# EAGLE schematic DingDingMusicCircuitBoard 1.0 (EAGLE 7.3.0)

## Sheet 1 of 4
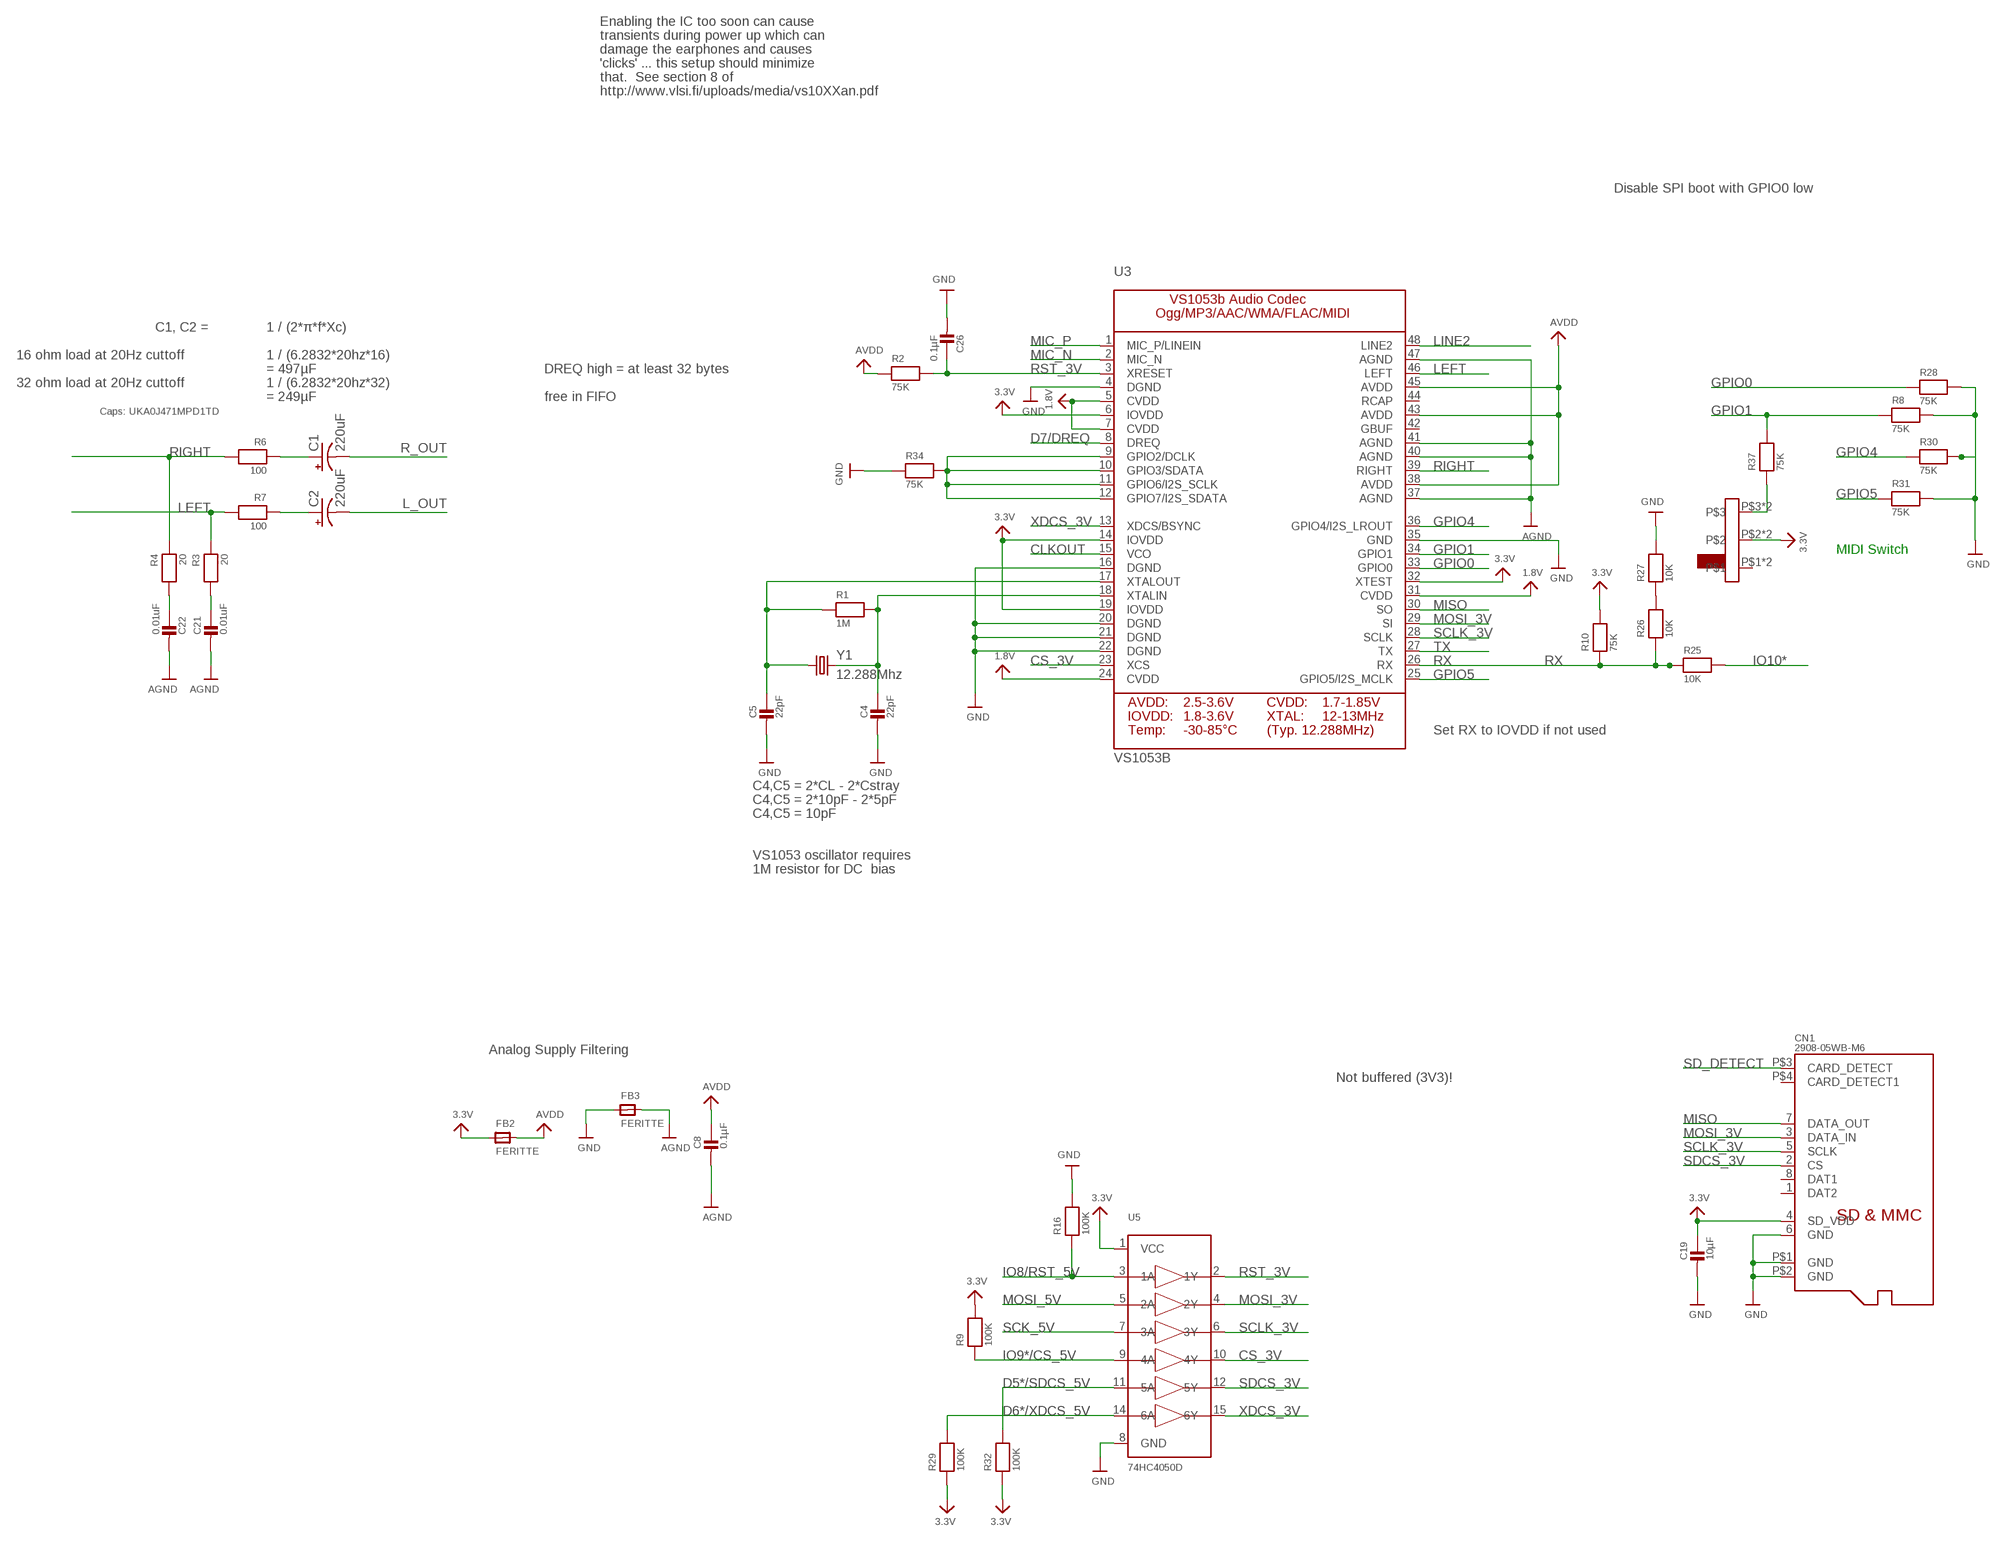
[diagram p0: schematic, sheet 1]

### Parts
C1  220uF  CPOL-USD  [PANASONIC_D]
C2  220uF  CPOL-USD  [PANASONIC_D]
C4  22pF  CAP_CERAMIC_0603MP  [_0603MP]
C5  22pF  CAP_CERAMIC_0603MP  [_0603MP]
C8  0.1µF  CAP_CERAMIC_0603MP  [_0603MP]
C19  10µF  CAP_CERAMIC_0603MP  [_0603MP]
C21  0.01uF  CAP_CERAMIC_0603MP  [_0603MP]
C22  0.01uF  CAP_CERAMIC_0603MP  [_0603MP]
C26  0.1µF  CAP_CERAMIC_0603MP  [_0603MP]
CN1  2908-05WB-M6  MICROSDMSDC-M61408  [MICROSD_MSDC-M61408]
FB2  FERITTE  FERRITE_0805MP  [_0805MP]
FB3  FERITTE  FERRITE_0805MP  [_0805MP]
R1  1M  RESISTOR_0603MP  [_0603MP]
R2  75K  RESISTOR_0603MP  [_0603MP]
R3  20  RESISTOR_0603MP  [_0603MP]
R4  20  RESISTOR_0603MP  [_0603MP]
R6  100  RESISTOR_0603MP  [_0603MP]
R7  100  RESISTOR_0603MP  [_0603MP]
R8  75K  RESISTOR_0603MP  [_0603MP]
R9  100K  RESISTOR_0603MP  [_0603MP]
R10  75K  RESISTOR_0603MP  [_0603MP]
R16  100K  RESISTOR_0603MP  [_0603MP]
R25  10K  RESISTOR_0603MP  [_0603MP]
R26  10K  RESISTOR_0603MP  [_0603MP]
R27  10K  RESISTOR_0603MP  [_0603MP]
R28  75K  RESISTOR_0603MP  [_0603MP]
R29  100K  RESISTOR_0603MP  [_0603MP]
R30  75K  RESISTOR_0603MP  [_0603MP]
R31  75K  RESISTOR_0603MP  [_0603MP]
R32  100K  RESISTOR_0603MP  [_0603MP]
R34  75K  RESISTOR_0603MP  [_0603MP]
R37  75K  RESISTOR_0603MP  [_0603MP]
U3  VS1053B  [LQFP48]
U5  74HC4050D  [SOIC16]
U$42  SWITCH_SK-02ACTS-2235S  [SWITCH_CTS-2235S]
Y1  12.288Mhz  CRYSTAL5X3  [CRYSTAL-SMD-5X3]

### Nets
1.8V: U3.5(CVDD) U3.7(CVDD) U3.24(CVDD) U3.31(CVDD) ; also sheet 3
3.3V: C19.1 CN1.4(SD_VDD) FB2.1 R9.2 R10.2 R29.1 R32.1 U3.6(IOVDD) U3.14(IOVDD) U3.19(IOVDD) U3.32(XTEST) U5.1(VCC) U$42.P$2 U$42.P$5 ; also sheet 2,3,4
AGND: C8.2 C21.2 C22.2 FB3.2 U3.37(AGND) U3.40(AGND) U3.41(AGND) U3.47(AGND) ; also sheet 4
AVDD: C8.1 FB2.2 R2.1 U3.38(AVDD) U3.43(AVDD) U3.45(AVDD)
CLKOUT: U3.15(VCO)
CS_3V: U3.23(XCS) U5.10(4Y)
D5*/SDCS_5V: R32.2 U5.11(5A) ; also sheet 3
D6*/XDCS_5V: R29.2 U5.14(6A) ; also sheet 3
D7/DREQ: U3.8(DREQ) ; also sheet 3
GND: C4.2 C5.2 C19.2 C26.2 CN1.6(GND) CN1.P$1(GND) CN1.P$2(GND) FB3.1 R8.2 R16.2 R27.2 R28.2 R30.2 R31.2 R34.1 U3.4(DGND) U3.16(DGND) U3.20(DGND) U3.21(DGND) U3.22(DGND) U3.35(GND) U5.8(GND) ; also sheet 2,3,4
GPIO0: R28.1 U3.33(GPIO0)
GPIO1: R8.1 R37.2 U3.34(GPIO1) ; also sheet 3
GPIO3: R34.2 U3.9(GPIO2/DCLK) U3.10(GPIO3/SDATA) U3.11(GPIO6/I2S_SCLK) U3.12(GPIO7/I2S_SDATA)
GPIO4: R30.1 U3.36(GPIO4/I2S_LROUT)
GPIO5: R31.1 U3.25(GPIO5/I2S_MCLK)
IO8/RST_5V: R16.1 U5.3(1A) ; also sheet 3
IO9*/CS_5V: R9.1 U5.9(4A) ; also sheet 3
IO10*: R25.2 ; also sheet 3
L_OUT: C2.- ; also sheet 4
LEFT: R3.1 R7.2 U3.46(LEFT)
LEFT_FILTERED: C2.+ R7.1
LINE2: U3.48(LINE2)
MIC_N: U3.2(MIC_N)
MIC_P: U3.1(MIC_P/LINEIN)
MISO: CN1.7(DATA_OUT) U3.30(SO) ; also sheet 3
MOSI_3V: CN1.3(DATA_IN) U3.29(SI) U5.4(2Y)
MOSI_5V: U5.5(2A) ; also sheet 3
N$1: C5.1 R1.1 U3.17(XTALOUT) Y1.1
N$2: C4.1 R1.2 U3.18(XTALIN) Y1.3
N$5: C21.1 R3.2
N$6: C22.1 R4.2
N$14: R37.1 U$42.P$3 U$42.P$6
N$28: R26.2 R27.1
R_OUT: C1.- ; also sheet 4
RIGHT: R4.1 R6.2 U3.39(RIGHT)
RIGHT_FILTERED: C1.+ R6.1
RST_3V: C26.1 R2.2 U3.3(XRESET) U5.2(1Y)
RX: R10.1 R25.1 R26.1 U3.26(RX)
SCK_5V: U5.7(3A) ; also sheet 3
SCLK_3V: CN1.5(SCLK) U3.28(SCLK) U5.6(3Y)
SD_DETECT: CN1.P$3(CARD_DETECT)
SDCS_3V: CN1.2(CS) U5.12(5Y)
TX: U3.27(TX)
XDCS_3V: U3.13(XDCS/BSYNC) U5.15(6Y)
Unconnected: CN1.1(DAT2) CN1.8(DAT1) CN1.P$4(CARD_DETECT1) U3.42(GBUF) U3.44(RCAP) U$42.P$1 U$42.P$4

### Notes on the sheet
- Enabling the IC too soon can cause
- transients during power up which can
- damage the earphones and causes
- 'clicks' ... this setup should minimize
- that.  See section 8 of
- http://www.vlsi.fi/uploads/media/vs10XXan.pdf
- Disable SPI boot with GPIO0 low
- C1, C2 = | 1 / (2*π*f*Xc)
- 16 ohm load at 20Hz cuttoff | 1 / (6.2832*20hz*16)
- = 497µF | DREQ high = at least 32 bytes
- 32 ohm load at 20Hz cuttoff | 1 / (6.2832*20hz*32)
- = 249µF | free in FIFO
- Caps: UKA0J471MPD1TD
- MIDI Switch
- Set RX to IOVDD if not used
- C4,C5 = 2*CL - 2*Cstray
- C4,C5 = 2*10pF - 2*5pF
- C4,C5 = 10pF
- VS1053 oscillator requires
- 1M resistor for DC  bias
- Analog Supply Filtering
- Not buffered (3V3)!

## Sheet 2 of 4
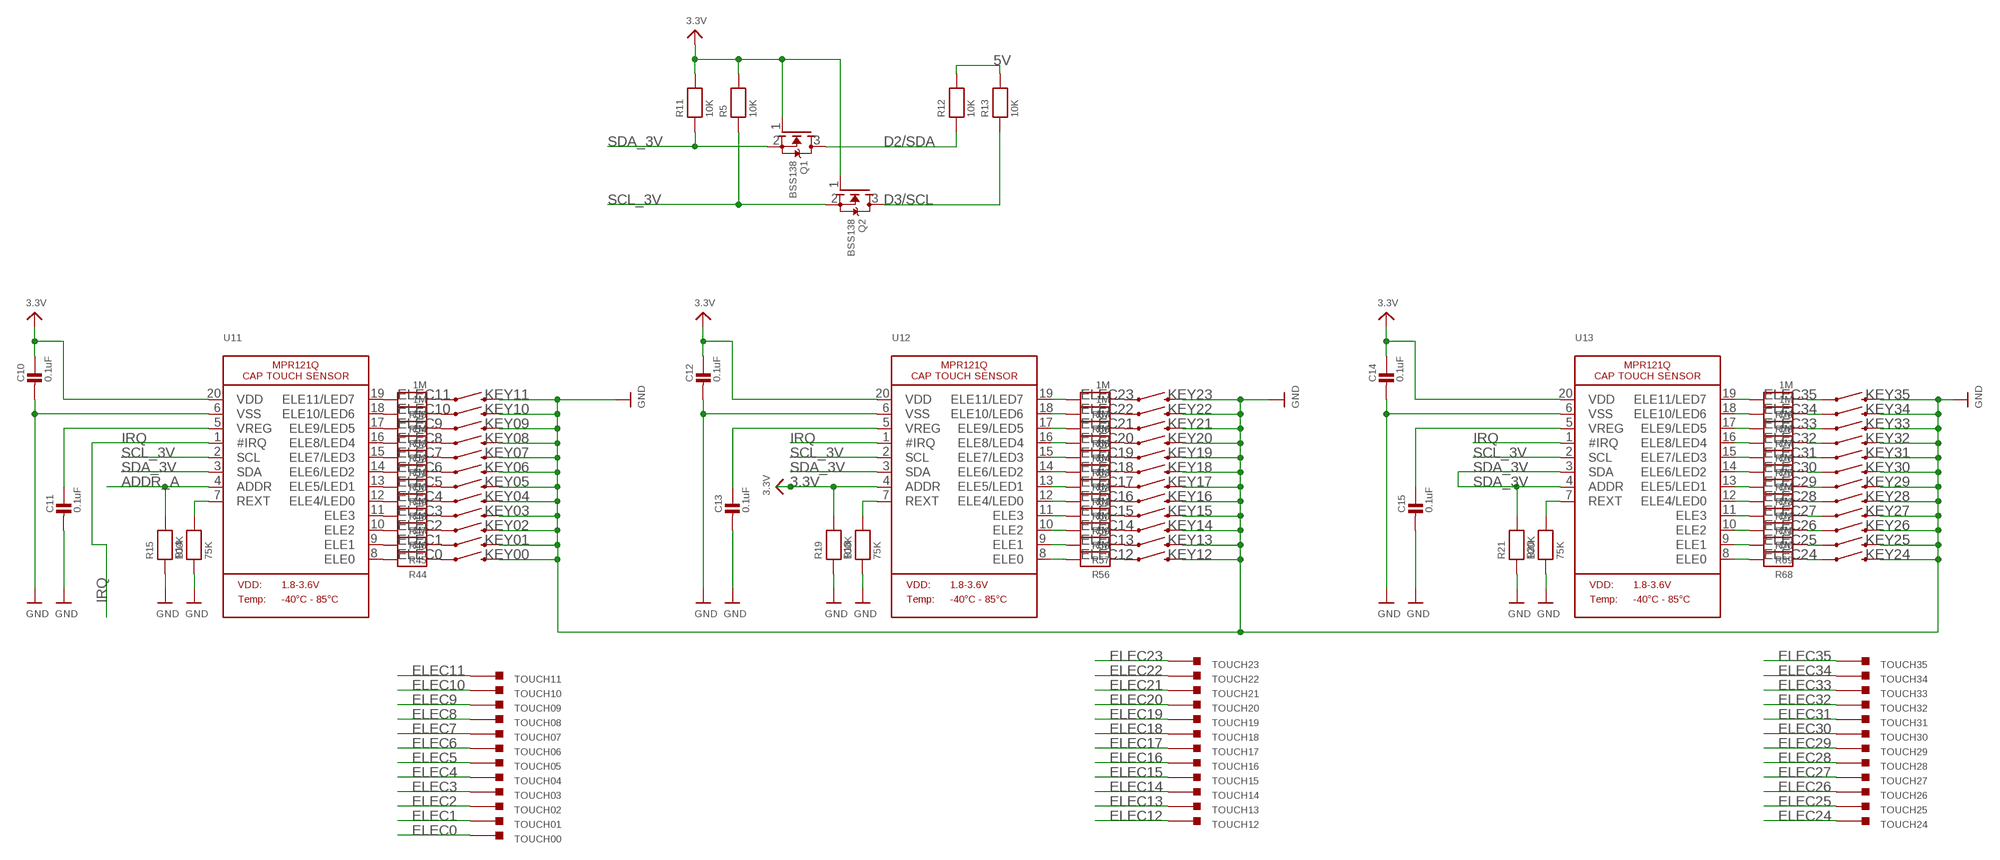
[diagram p1: schematic, sheet 2]

### Parts
C10  0.1uF  CAP_CERAMIC_0603MP  [_0603MP]
C11  0.1uF  CAP_CERAMIC_0603MP  [_0603MP]
C12  0.1uF  CAP_CERAMIC_0603MP  [_0603MP]
C13  0.1uF  CAP_CERAMIC_0603MP  [_0603MP]
C14  0.1uF  CAP_CERAMIC_0603MP  [_0603MP]
C15  0.1uF  CAP_CERAMIC_0603MP  [_0603MP]
KEY00  SWITCH-MOMENTARY-2  [TACTILE_SWITCH_TALL]
KEY01  SWITCH-MOMENTARY-2  [TACTILE_SWITCH_TALL]
KEY02  SWITCH-MOMENTARY-2  [TACTILE_SWITCH_TALL]
KEY03  SWITCH-MOMENTARY-2  [TACTILE_SWITCH_TALL]
KEY04  SWITCH-MOMENTARY-2  [TACTILE_SWITCH_TALL]
KEY05  SWITCH-MOMENTARY-2  [TACTILE_SWITCH_TALL]
KEY06  SWITCH-MOMENTARY-2  [TACTILE_SWITCH_TALL]
KEY07  SWITCH-MOMENTARY-2  [TACTILE_SWITCH_TALL]
KEY08  SWITCH-MOMENTARY-2  [TACTILE_SWITCH_TALL]
KEY09  SWITCH-MOMENTARY-2  [TACTILE_SWITCH_TALL]
KEY10  SWITCH-MOMENTARY-2  [TACTILE_SWITCH_TALL]
KEY11  SWITCH-MOMENTARY-2  [TACTILE_SWITCH_TALL]
KEY12  SWITCH-MOMENTARY-2  [TACTILE_SWITCH_TALL]
KEY13  SWITCH-MOMENTARY-2  [TACTILE_SWITCH_TALL]
KEY14  SWITCH-MOMENTARY-2  [TACTILE_SWITCH_TALL]
KEY15  SWITCH-MOMENTARY-2  [TACTILE_SWITCH_TALL]
KEY16  SWITCH-MOMENTARY-2  [TACTILE_SWITCH_TALL]
KEY17  SWITCH-MOMENTARY-2  [TACTILE_SWITCH_TALL]
KEY18  SWITCH-MOMENTARY-2  [TACTILE_SWITCH_TALL]
KEY19  SWITCH-MOMENTARY-2  [TACTILE_SWITCH_TALL]
KEY20  SWITCH-MOMENTARY-2  [TACTILE_SWITCH_TALL]
KEY21  SWITCH-MOMENTARY-2  [TACTILE_SWITCH_TALL]
KEY22  SWITCH-MOMENTARY-2  [TACTILE_SWITCH_TALL]
KEY23  SWITCH-MOMENTARY-2  [TACTILE_SWITCH_TALL]
KEY24  SWITCH-MOMENTARY-2  [TACTILE_SWITCH_TALL]
KEY25  SWITCH-MOMENTARY-2  [TACTILE_SWITCH_TALL]
KEY26  SWITCH-MOMENTARY-2  [TACTILE_SWITCH_TALL]
KEY27  SWITCH-MOMENTARY-2  [TACTILE_SWITCH_TALL]
KEY28  SWITCH-MOMENTARY-2  [TACTILE_SWITCH_TALL]
KEY29  SWITCH-MOMENTARY-2  [TACTILE_SWITCH_TALL]
KEY30  SWITCH-MOMENTARY-2  [TACTILE_SWITCH_TALL]
KEY31  SWITCH-MOMENTARY-2  [TACTILE_SWITCH_TALL]
KEY32  SWITCH-MOMENTARY-2  [TACTILE_SWITCH_TALL]
KEY33  SWITCH-MOMENTARY-2  [TACTILE_SWITCH_TALL]
KEY34  SWITCH-MOMENTARY-2  [TACTILE_SWITCH_TALL]
KEY35  SWITCH-MOMENTARY-2  [TACTILE_SWITCH_TALL]
Q1  BSS138  MOSFET-NWIDE  [SOT23-WIDE@1]
Q2  BSS138  MOSFET-NWIDE  [SOT23-WIDE@1]
R5  10K  RESISTOR_0603MP  [_0603MP]
R11  10K  RESISTOR_0603MP  [_0603MP]
R12  10K  RESISTOR_0603MP  [_0603MP]
R13  10K  RESISTOR_0603MP  [_0603MP]
R14  75K  RESISTOR_0603MP  [_0603MP]
R15  100K  RESISTOR_0603MP  [_0603MP]
R18  75K  RESISTOR_0603MP  [_0603MP]
R19  100K  RESISTOR_0603MP  [_0603MP]
R20  75K  RESISTOR_0603MP  [_0603MP]
R21  100K  RESISTOR_0603MP  [_0603MP]
R44  1M  RESISTOR_0603MP  [_0603MP]
R45  1M  RESISTOR_0603MP  [_0603MP]
R46  1M  RESISTOR_0603MP  [_0603MP]
R47  1M  RESISTOR_0603MP  [_0603MP]
R48  1M  RESISTOR_0603MP  [_0603MP]
R49  1M  RESISTOR_0603MP  [_0603MP]
R50  1M  RESISTOR_0603MP  [_0603MP]
R51  1M  RESISTOR_0603MP  [_0603MP]
R52  1M  RESISTOR_0603MP  [_0603MP]
R53  1M  RESISTOR_0603MP  [_0603MP]
R54  1M  RESISTOR_0603MP  [_0603MP]
R55  1M  RESISTOR_0603MP  [_0603MP]
R56  1M  RESISTOR_0603MP  [_0603MP]
R57  1M  RESISTOR_0603MP  [_0603MP]
R58  1M  RESISTOR_0603MP  [_0603MP]
R59  1M  RESISTOR_0603MP  [_0603MP]
R60  1M  RESISTOR_0603MP  [_0603MP]
R61  1M  RESISTOR_0603MP  [_0603MP]
R62  1M  RESISTOR_0603MP  [_0603MP]
R63  1M  RESISTOR_0603MP  [_0603MP]
R64  1M  RESISTOR_0603MP  [_0603MP]
R65  1M  RESISTOR_0603MP  [_0603MP]
R66  1M  RESISTOR_0603MP  [_0603MP]
R67  1M  RESISTOR_0603MP  [_0603MP]
R68  1M  RESISTOR_0603MP  [_0603MP]
R69  1M  RESISTOR_0603MP  [_0603MP]
R70  1M  RESISTOR_0603MP  [_0603MP]
R71  1M  RESISTOR_0603MP  [_0603MP]
R72  1M  RESISTOR_0603MP  [_0603MP]
R73  1M  RESISTOR_0603MP  [_0603MP]
R74  1M  RESISTOR_0603MP  [_0603MP]
R75  1M  RESISTOR_0603MP  [_0603MP]
R76  1M  RESISTOR_0603MP  [_0603MP]
R77  1M  RESISTOR_0603MP  [_0603MP]
R78  1M  RESISTOR_0603MP  [_0603MP]
R79  1M  RESISTOR_0603MP  [_0603MP]
TOUCH00  RDD_TOUCH_PAD  [RDD_TOUCH_PAD]
TOUCH01  RDD_TOUCH_PAD  [RDD_TOUCH_PAD]
TOUCH02  RDD_TOUCH_PAD  [RDD_TOUCH_PAD]
TOUCH03  RDD_TOUCH_PAD  [RDD_TOUCH_PAD]
TOUCH04  RDD_TOUCH_PAD  [RDD_TOUCH_PAD]
TOUCH05  RDD_TOUCH_PAD  [RDD_TOUCH_PAD]
TOUCH06  RDD_TOUCH_PAD  [RDD_TOUCH_PAD]
TOUCH07  RDD_TOUCH_PAD  [RDD_TOUCH_PAD]
TOUCH08  RDD_TOUCH_PAD  [RDD_TOUCH_PAD]
TOUCH09  RDD_TOUCH_PAD  [RDD_TOUCH_PAD]
TOUCH10  RDD_TOUCH_PAD  [RDD_TOUCH_PAD]
TOUCH11  RDD_TOUCH_PAD  [RDD_TOUCH_PAD]
TOUCH12  RDD_TOUCH_PAD  [RDD_TOUCH_PAD]
TOUCH13  RDD_TOUCH_PAD  [RDD_TOUCH_PAD]
TOUCH14  RDD_TOUCH_PAD  [RDD_TOUCH_PAD]
TOUCH15  RDD_TOUCH_PAD  [RDD_TOUCH_PAD]
TOUCH16  RDD_TOUCH_PAD  [RDD_TOUCH_PAD]
TOUCH17  RDD_TOUCH_PAD  [RDD_TOUCH_PAD]
TOUCH18  RDD_TOUCH_PAD  [RDD_TOUCH_PAD]
TOUCH19  RDD_TOUCH_PAD  [RDD_TOUCH_PAD]
TOUCH20  RDD_TOUCH_PAD  [RDD_TOUCH_PAD]
TOUCH21  RDD_TOUCH_PAD  [RDD_TOUCH_PAD]
TOUCH22  RDD_TOUCH_PAD  [RDD_TOUCH_PAD]
TOUCH23  RDD_TOUCH_PAD  [RDD_TOUCH_PAD]
TOUCH24  RDD_TOUCH_PAD  [RDD_TOUCH_PAD]
TOUCH25  RDD_TOUCH_PAD  [RDD_TOUCH_PAD]
TOUCH26  RDD_TOUCH_PAD  [RDD_TOUCH_PAD]
TOUCH27  RDD_TOUCH_PAD  [RDD_TOUCH_PAD]
TOUCH28  RDD_TOUCH_PAD  [RDD_TOUCH_PAD]
TOUCH29  RDD_TOUCH_PAD  [RDD_TOUCH_PAD]
TOUCH30  RDD_TOUCH_PAD  [RDD_TOUCH_PAD]
TOUCH31  RDD_TOUCH_PAD  [RDD_TOUCH_PAD]
TOUCH32  RDD_TOUCH_PAD  [RDD_TOUCH_PAD]
TOUCH33  RDD_TOUCH_PAD  [RDD_TOUCH_PAD]
TOUCH34  RDD_TOUCH_PAD  [RDD_TOUCH_PAD]
TOUCH35  RDD_TOUCH_PAD  [RDD_TOUCH_PAD]
U11  MPR121Q  [QFN20_3MM_NOTHERMAL]
U12  MPR121Q  [QFN20_3MM_NOTHERMAL]
U13  MPR121Q  [QFN20_3MM_NOTHERMAL]

### Nets
3.3V: C10.1 C12.1 C14.1 Q1.1(G) Q2.1(G) R5.2 R11.2 R19.2 U11.20(VDD) U12.4(ADDR) U12.20(VDD) U13.20(VDD) ; also sheet 1,3,4
5V: R12.2 R13.2 ; also sheet 3
ADDR_A: R15.2 U11.4(ADDR)
D2/SDA: Q1.3(D) R12.1 ; also sheet 3
D3/SCL: Q2.3(D) R13.1 ; also sheet 3
ELEC0: R44.2 TOUCH00.P$1 U11.8(ELE0)
ELEC1: R45.2 TOUCH01.P$1 U11.9(ELE1)
ELEC2: R46.2 TOUCH02.P$1 U11.10(ELE2)
ELEC3: R47.2 TOUCH03.P$1 U11.11(ELE3)
ELEC4: R48.2 TOUCH04.P$1 U11.12(ELE4/LED0)
ELEC5: R49.2 TOUCH05.P$1 U11.13(ELE5/LED1)
ELEC6: R50.2 TOUCH06.P$1 U11.14(ELE6/LED2)
ELEC7: R51.2 TOUCH07.P$1 U11.15(ELE7/LED3)
ELEC8: R52.2 TOUCH08.P$1 U11.16(ELE8/LED4)
ELEC9: R53.2 TOUCH09.P$1 U11.17(ELE9/LED5)
ELEC10: R54.2 TOUCH10.P$1 U11.18(ELE10/LED6)
ELEC11: R55.2 TOUCH11.P$1 U11.19(ELE11/LED7)
ELEC12: R56.2 TOUCH12.P$1 U12.8(ELE0)
ELEC13: R57.2 TOUCH13.P$1 U12.9(ELE1)
ELEC14: R58.2 TOUCH14.P$1 U12.10(ELE2)
ELEC15: R59.2 TOUCH15.P$1 U12.11(ELE3)
ELEC16: R60.2 TOUCH16.P$1 U12.12(ELE4/LED0)
ELEC17: R61.2 TOUCH17.P$1 U12.13(ELE5/LED1)
ELEC18: R62.2 TOUCH18.P$1 U12.14(ELE6/LED2)
ELEC19: R63.2 TOUCH19.P$1 U12.15(ELE7/LED3)
ELEC20: R64.2 TOUCH20.P$1 U12.16(ELE8/LED4)
ELEC21: R65.2 TOUCH21.P$1 U12.17(ELE9/LED5)
ELEC22: R66.2 TOUCH22.P$1 U12.18(ELE10/LED6)
ELEC23: R67.2 TOUCH23.P$1 U12.19(ELE11/LED7)
ELEC24: R68.2 TOUCH24.P$1 U13.8(ELE0)
ELEC25: R69.2 TOUCH25.P$1 U13.9(ELE1)
ELEC26: R70.2 TOUCH26.P$1 U13.10(ELE2)
ELEC27: R71.2 TOUCH27.P$1 U13.11(ELE3)
ELEC28: R72.2 TOUCH28.P$1 U13.12(ELE4/LED0)
ELEC29: R73.2 TOUCH29.P$1 U13.13(ELE5/LED1)
ELEC30: R74.2 TOUCH30.P$1 U13.14(ELE6/LED2)
ELEC31: R75.2 TOUCH31.P$1 U13.15(ELE7/LED3)
ELEC32: R76.2 TOUCH32.P$1 U13.16(ELE8/LED4)
ELEC33: R77.2 TOUCH33.P$1 U13.17(ELE9/LED5)
ELEC34: R78.2 TOUCH34.P$1 U13.18(ELE10/LED6)
ELEC35: R79.2 TOUCH35.P$1 U13.19(ELE11/LED7)
GND: C10.2 C11.2 C12.2 C13.2 C14.2 C15.2 KEY00.B1 KEY00.B2 KEY01.B1 KEY01.B2 KEY02.B1 KEY02.B2 KEY03.B1 KEY03.B2 KEY04.B1 KEY04.B2 KEY05.B1 KEY05.B2 KEY06.B1 KEY06.B2 KEY07.B1 KEY07.B2 KEY08.B1 KEY08.B2 KEY09.B1 KEY09.B2 KEY10.B1 KEY10.B2 KEY11.B1 KEY11.B2 KEY12.B1 KEY12.B2 KEY13.B1 KEY13.B2 KEY14.B1 KEY14.B2 KEY15.B1 KEY15.B2 KEY16.B1 KEY16.B2 KEY17.B1 KEY17.B2 KEY18.B1 KEY18.B2 KEY19.B1 KEY19.B2 KEY20.B1 KEY20.B2 KEY21.B1 KEY21.B2 KEY22.B1 KEY22.B2 KEY23.B1 KEY23.B2 KEY24.B1 KEY24.B2 KEY25.B1 KEY25.B2 KEY26.B1 KEY26.B2 KEY27.B1 KEY27.B2 KEY28.B1 KEY28.B2 KEY29.B1 KEY29.B2 KEY30.B1 KEY30.B2 KEY31.B1 KEY31.B2 KEY32.B1 KEY32.B2 KEY33.B1 KEY33.B2 KEY34.B1 KEY34.B2 KEY35.B1 KEY35.B2 R14.1 R15.1 R18.1 R19.1 R20.1 R21.1 U11.6(VSS) U12.6(VSS) U13.6(VSS) ; also sheet 1,3,4
IRQ: U11.1(#IRQ) U12.1(#IRQ) U13.1(#IRQ) ; also sheet 3
N$3: C11.1 U11.5(VREG)
N$4: R14.2 U11.7(REXT)
N$8: C13.1 U12.5(VREG)
N$9: R18.2 U12.7(REXT)
N$10: C15.1 U13.5(VREG)
N$11: R20.2 U13.7(REXT)
N$25: KEY00.A1 KEY00.A2 R44.1
N$32: KEY01.A1 KEY01.A2 R45.1
N$34: KEY02.A1 KEY02.A2 R46.1
N$35: KEY03.A1 KEY03.A2 R47.1
N$36: KEY04.A1 KEY04.A2 R48.1
N$37: KEY05.A1 KEY05.A2 R49.1
N$38: KEY06.A1 KEY06.A2 R50.1
N$39: KEY07.A1 KEY07.A2 R51.1
N$40: KEY08.A1 KEY08.A2 R52.1
N$41: KEY09.A1 KEY09.A2 R53.1
N$42: KEY10.A1 KEY10.A2 R54.1
N$43: KEY11.A1 KEY11.A2 R55.1
N$44: KEY12.A1 KEY12.A2 R56.1
N$45: KEY13.A1 KEY13.A2 R57.1
N$46: KEY14.A1 KEY14.A2 R58.1
N$47: KEY15.A1 KEY15.A2 R59.1
N$48: KEY16.A1 KEY16.A2 R60.1
N$49: KEY17.A1 KEY17.A2 R61.1
N$50: KEY18.A1 KEY18.A2 R62.1
N$51: KEY19.A1 KEY19.A2 R63.1
N$52: KEY20.A1 KEY20.A2 R64.1
N$53: KEY21.A1 KEY21.A2 R65.1
N$54: KEY22.A1 KEY22.A2 R66.1
N$55: KEY23.A1 KEY23.A2 R67.1
N$56: KEY24.A1 KEY24.A2 R68.1
N$57: KEY25.A1 KEY25.A2 R69.1
N$58: KEY26.A1 KEY26.A2 R70.1
N$59: KEY27.A1 KEY27.A2 R71.1
N$60: KEY28.A1 KEY28.A2 R72.1
N$61: KEY29.A1 KEY29.A2 R73.1
N$62: KEY30.A1 KEY30.A2 R74.1
N$63: KEY31.A1 KEY31.A2 R75.1
N$64: KEY32.A1 KEY32.A2 R76.1
N$65: KEY33.A1 KEY33.A2 R77.1
N$66: KEY34.A1 KEY34.A2 R78.1
N$67: KEY35.A1 KEY35.A2 R79.1
SCL_3V: Q2.2(S) R5.1 U11.2(SCL) U12.2(SCL) U13.2(SCL)
SDA_3V: Q1.2(S) R11.1 R21.2 U11.3(SDA) U12.3(SDA) U13.3(SDA) U13.4(ADDR)

## Sheet 3 of 4
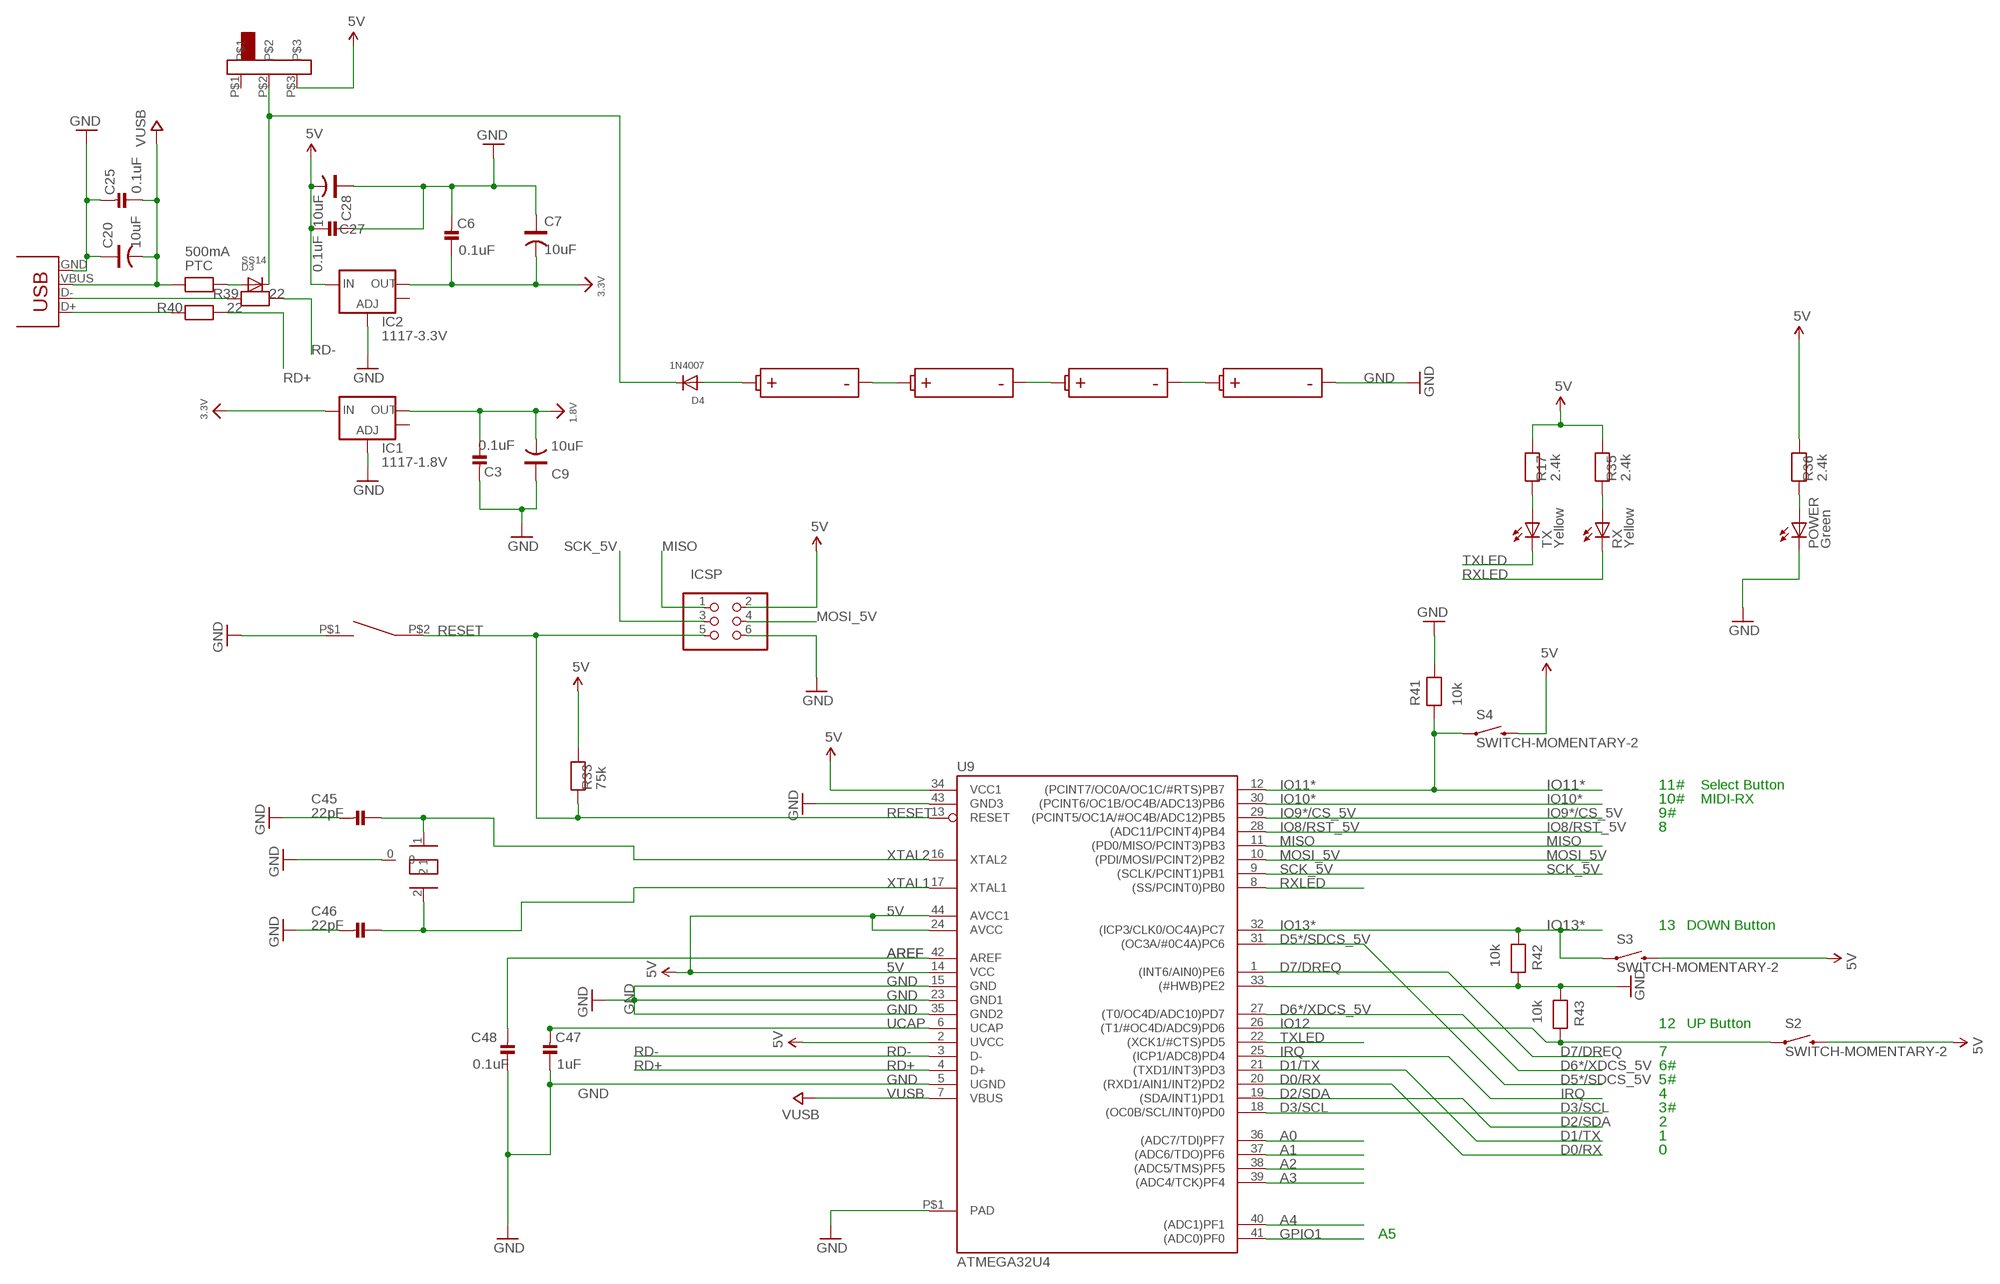
[diagram p2: schematic, sheet 3]

### Parts
AAA01  AAA_CLIP  [AAA_CLIP]
AAA02  AAA_CLIP  [AAA_CLIP]
AAA03  AAA_CLIP  [AAA_CLIP]
AAA04  AAA_CLIP  [AAA_CLIP]
C3  0.1uF  CAP_CERAMIC_0805MP  [_0805MP]
C6  0.1uF  CAP_CERAMIC_0805MP  [_0805MP]
C7  10uF  CAP1206  [1206]
C9  10uF  CAP1206  [1206]
C20  10uF  CAP1206  [1206]
C25  0.1uF  CAP_CERAMIC_0805MP  [_0805MP]
C27  0.1uF  CAP_CERAMIC_0805MP  [_0805MP]
C28  10uF  CAP1206  [1206]
C45  22pF  CAP_CERAMIC_0603MP  [_0603MP]
C46  22pF  CAP_CERAMIC_0603MP  [_0603MP]
C47  1uF  CAP_CERAMIC_0603MP  [_0603MP]
C48  0.1uF  CAP_CERAMIC_0603MP  [_0603MP]
D3  SS14  DIODESOD-123  [SOD-123]
D4  1N4007  DIODESOD-123  [SOD-123]
IC1  1117-1.8V  V_REG_LM1117SOT223  [SOT223]
IC2  1117-3.3V  V_REG_LM1117SOT223  [SOT223]
ICSP  ICSP  PINHD-2X3  [2X03]
POWER  Green  LEDCHIPLED_0805  [CHIPLED_0805]
PTC  500mA  RESISTOR_0805MP  [_0805MP]
R17  2.4k  RESISTOR_0603MP  [_0603MP]
R33  75k  RESISTOR_0603MP  [_0603MP]
R35  2.4k  RESISTOR_0603MP  [_0603MP]
R36  2.4k  RESISTOR_0603MP  [_0603MP]
R39  22  RESISTOR_0603MP  [_0603MP]
R40  22  RESISTOR_0603MP  [_0603MP]
R41  10k  RESISTOR_0603MP  [_0603MP]
R42  10k  RESISTOR_0603MP  [_0603MP]
R43  10k  RESISTOR_0603MP  [_0603MP]
RESET  TACT_SWITCHSMALL  [TACT_SWITCH_SMALL]
RX  Yellow  LEDCHIPLED_0805  [CHIPLED_0805]
S2  SWITCH-MOMENTARY-2  [TACTILE_SWITCH_TALL]
S3  SWITCH-MOMENTARY-2  [TACTILE_SWITCH_TALL]
S4  SWITCH-MOMENTARY-2  [TACTILE_SWITCH_TALL]
TX  Yellow  LEDCHIPLED_0805  [CHIPLED_0805]
U9  ATMEGA32U4  ATMEGA32U4-XUAU  [TQFP44-PAD]
U$44  SWITCH_SK-02ACTS-1280  [SWITCH_CTS-1280]
U$47  MURATA_CRYSTAL  [MURATA_CRYSTAL]
U$70  MICRO_USB  [MICRO_USB]

### Nets
1.8V: C3.1 C9.2 IC1.2(OUT) ; also sheet 1
3.3V: C6.1 C7.2 IC1.3(IN) IC2.2(OUT) ; also sheet 1,2,4
5V: C27.1 C28.2 IC2.3(IN) ICSP.2 R17.1 R33.1 R35.1 R36.1 S2.B1 S2.B2 S3.B1 S3.B2 S4.B1 S4.B2 U9.2(UVCC) U9.14(VCC) U9.24(AVCC) U9.34(VCC1) U9.44(AVCC1) U$44.P$3 ; also sheet 2
A0: U9.36((ADC7/TDI)PF7)
A1: U9.37((ADC6/TDO)PF6)
A2: U9.38((ADC5/TMS)PF5)
A3: U9.39((ADC4/TCK)PF4)
A4: U9.40((ADC1)PF1)
AREF [aref]: C48.2 U9.42(AREF)
D0/RX: U9.20((RXD1/AIN1/INT2)PD2)
D1/TX: U9.21((TXD1/INT3)PD3)
D2/SDA: U9.19((SDA/INT1)PD1) ; also sheet 2
D3/SCL: U9.18((OC0B/SCL/INT0)PD0) ; also sheet 2
D5*/SDCS_5V: U9.31((OC3A/#0C4A)PC6) ; also sheet 1
D6*/XDCS_5V: U9.27((T0/OC4D/ADC10)PD7) ; also sheet 1
D7/DREQ: U9.1((INT6/AIN0)PE6) ; also sheet 1
GND: AAA04.P$3-(P$2-) AAA04.P$4-(P$2-) C3.2 C6.2 C7.1 C9.1 C20.1 C25.2 C27.2 C28.1 C45.2 C46.2 C47.1 C48.1 IC1.1(ADJ) IC2.1(ADJ) ICSP.6 POWER.C R41.1 R42.1 R43.2 RESET.P$1 U9.5(UGND) U9.15(GND) U9.23(GND1) U9.33((#HWB)PE2) U9.35(GND2) U9.43(GND3) U9.P$1(PAD) U$47.0 U$70.GND ; also sheet 1,2,4
GPIO1: U9.41((ADC0)PF0) ; also sheet 1
IO8/RST_5V: U9.28((ADC11/PCINT4)PB4) ; also sheet 1
IO9*/CS_5V: U9.29((PCINT5/OC1A/#OC4B/ADC12)PB5) ; also sheet 1
IO10*: U9.30((PCINT6/OC1B/OC4B/ADC13)PB6) ; also sheet 1
IO11*: R41.2 S4.A1 S4.A2 U9.12((PCINT7/OC0A/OC1C/#RTS)PB7)
IO12: R43.1 S2.A1 S2.A2 U9.26((T1/#OC4D/ADC9)PD6)
IO13*: R42.2 S3.A1 S3.A2 U9.32((ICP3/CLK0/OC4A)PC7)
IRQ: U9.25((ICP1/ADC8)PD4) ; also sheet 2
MISO: ICSP.1 U9.11((PD0/MISO/PCINT3)PB3) ; also sheet 1
MOSI_5V: ICSP.4 U9.10((PDI/MOSI/PCINT2)PB2) ; also sheet 1
N$13: POWER.A R36.2
N$21: D3.A PTC.1
N$22: AAA01.P$3-(P$2-) AAA01.P$4-(P$2-) AAA02.P$1+ AAA02.P$2+(P$1+)
N$23: AAA02.P$3-(P$2-) AAA02.P$4-(P$2-) AAA03.P$1+ AAA03.P$2+(P$1+)
N$24: R17.2 TX.A
N$26: R35.2 RX.A
N$27: AAA01.P$1+ AAA01.P$2+(P$1+) D4.A
N$29: AAA03.P$3-(P$2-) AAA03.P$4-(P$2-) AAA04.P$1+ AAA04.P$2+(P$1+)
N$30: R39.2 U$70.D-
N$31: R40.2 U$70.D+
N$33: D3.C D4.C U$44.P$2
RD+: R40.1 U9.4(D+)
RD-: R39.1 U9.3(D-)
RESET: ICSP.5 R33.2 RESET.P$2 U9.13(RESET)
RXLED: RX.C U9.8((SS/PCINT0)PB0)
SCK_5V: ICSP.3 U9.9((SCLK/PCINT1)PB1) ; also sheet 1
TXLED: TX.C U9.22((XCK1/#CTS)PD5)
UCAP: C47.2 U9.6(UCAP)
VUSB: C20.2 C25.1 PTC.2 U9.7(VBUS) U$70.VBUS
XTAL1: C46.1 U9.17(XTAL1) U$47.2
XTAL2: C45.1 U9.16(XTAL2) U$47.1
Unconnected: IC1.4(OUT) IC2.4(OUT) U$44.P$1

### Notes on the sheet
- 11# | Select Button
- 10# | MIDI-RX
- 9#
- 8
- 13 | DOWN Button
- 12 | UP Button
- 7
- 6#
- 5#
- 4
- 3#
- 2
- 1
- 0
- A5

## Sheet 4 of 4
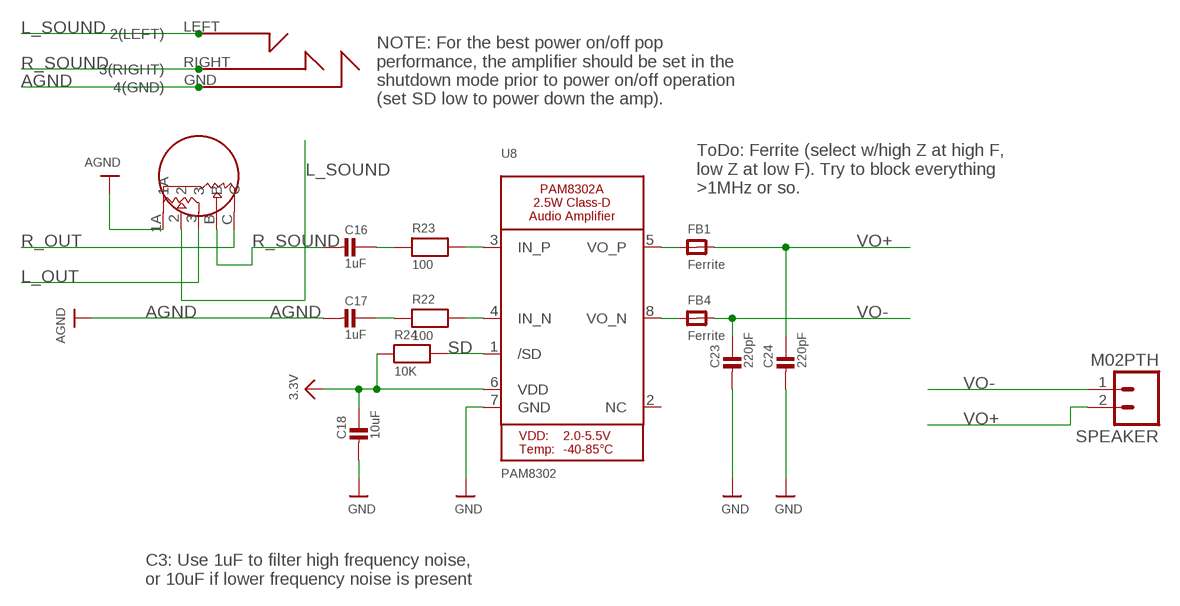
[diagram p3: schematic, sheet 4]

### Parts
C16  1uF  CAP_CERAMIC_0603MP  [_0603MP]
C17  1uF  CAP_CERAMIC_0603MP  [_0603MP]
C18  10uF  CAP_CERAMIC_0603MP  [_0603MP]
C23  220pF  CAP_CERAMIC_0603MP  [_0603MP]
C24  220pF  CAP_CERAMIC_0603MP  [_0603MP]
FB1  Ferrite  FERRITE_0805MP  [_0805MP]
FB4  Ferrite  FERRITE_0805MP  [_0805MP]
R22  100  RESISTOR_0603MP  [_0603MP]
R23  100  RESISTOR_0603MP  [_0603MP]
R24  10K  RESISTOR_0603MP  [_0603MP]
SPEAKER  M02PTH  [1X02]
U8  PAM8302  AUDIOAMP_PAM8302A  [MSOP8_0.65MM]
U$32  SOUND_VOLUME  [SOUND_VOLUME]
U$80  EARPHONE_DEV  [EARPHONE_PAC]

### Nets
3.3V: C18.1 R24.1 U8.6(VDD) ; also sheet 1,2,3
AGND: C17.2 U$32.1A U$80.GND(4(GND)) ; also sheet 1
GND: C18.2 C23.2 C24.2 U8.7(GND) ; also sheet 1,2,3
L_OUT: U$32.3 ; also sheet 1
L_SOUND: U$32.2 U$80.LEFT(2(LEFT))
N$15: R22.2 U8.4(IN_N)
N$16: R23.2 U8.3(IN_P)
N$17: C17.1 R22.1
N$18: FB4.1 U8.8(VO_N)
N$19: FB1.1 U8.5(VO_P)
N$20: C16.1 R23.1
R_OUT: U$32.C ; also sheet 1
R_SOUND: C16.2 U$32.B U$80.RIGHT(3(RIGHT))
SD: R24.2 U8.1(/SD)
VO+: C24.1 FB1.2 SPEAKER.2
VO-: C23.1 FB4.2 SPEAKER.1
Unconnected: U8.2(NC)

### Notes on the sheet
- NOTE: For the best power on/off pop
  performance, the amplifier should be set in the
  shutdown mode prior to power on/off operation
  (set SD low to power down the amp).
- ToDo: Ferrite (select w/high Z at high F,
  low Z at low F). Try to block everything
  >1MHz or so.
- C3: Use 1uF to filter high frequency noise,
  or 10uF if lower frequency noise is present

## Library data of the parts
AAA01-AAA04 = AAA_Clip:AAA_CLIP
C1 C2 = rcl:CPOL-US: POLARIZED CAPACITOR, American symbol
C3-C6 C8 C10-C19 C21-C27 C45-C48 = microbuilder:CAP_CERAMIC: Ceramic Capacitors For new designs, use the packages preceded by an '_' character since they are more reliable: The following footprints should be used on most boards: _0402 - Standard footprint for regular board layouts _0603 - Standard footprint for regular board layouts _0805 - Standard footprint for regular board layouts For extremely tight-pitch boards where space is at a premium, the following 'micro-pitch' footprints can be used (smaller pads, no silkscreen outline, etc.): _0402MP - Micro-pitch footprint for very dense/compact boards _0603MP - Micro-pitch footprint for very dense/compact boards _0805MP - Micro-pitch footprint for very dense/compact boards Commonly Stocked Parts 0402 - 0402 Surface Mount Capacitors 16pF 50V 5% [Digikey: 445-4899-2-ND] 18pF 50V 5% [Digikey: 490-1281-2-ND] 22pF 50V 5% [Digikey: 490-1283-2-ND] 68pF 50V 5% [Digikey: 490-1289-2-ND] 0.1uF 10V 10% [Digikey: 490-1318-2-ND] 1.0uF 6.3V 10% [Digikey: 490-1320-2-ND] 0603 - 0603 Surface Mount Capacitors 16 pF 50V 5% [Digikey: 445-5051-2-ND] 22 pF 50V [Digikey: PCC220ACVTR-ND] 33 pF 50V 5% [Digikey: 490-1415-1-ND] 56pF 50V 5% [Digikey: 490-1421-1-ND] 220pF 50V 5% [Digikey: 445-1285-1-ND] 680 pF 50V 2200 pF 50V 5% C0G [Digikey: 445-1297-1-ND] 5600 pF 100V 5% X7R [Digikey: 478-3711-1-ND] 0.1 µF 25V 10% [Digikey: PCC2277TR-ND] 0.22 µF 16V 10% X7R [Digikey: 445-1318-1-ND] 1.0 µF 25V 10% [Digikey: 445-5146-2-ND] 0603 - RF Specific 3pF 250V +/-0.1pF RF [Digikey: 712-1347-1-ND] 18 pF 250V 5% [Digikey: 478-3505-1-ND or 712-1322-1-ND] 56 pF 250V 5% C0G RF [Digikey: 490-4867-1-ND] 68 pF 250V RF [Digikey: 490-4868-1-ND] 0805 - 0805 Surface Mount Capacitors 220 pF 250V 2% RF Ceramic Capacitor [Digikey: 712-1398-1-ND] 1000 pF 50V 2% NP0 Ceramic Capacitor [Digikey: 478-3760-1-ND] 0.1 µF 25V 10% Ceramic Capacitor [Digikey: PCC1828TR-ND] 1.0 µF 16V 10% Ceramic Capacitor[Digikey: 490-1691-2-ND] 10.0 µF 10V 10% Ceramic Capacitor[Digikey: 709-1228-1-ND] 10.0 uF 16V 10% Ceramic Capacitor [Digikey: 478-5165-2-ND] 47 uF 6.3V 20% Ceramic Capacitor [Digikey: 587-1779-1-ND or 399-5506-1-ND] 1206 - 1206 Surface Mount Capacitors 47uF 10V 20% Ceramic Capacitor [Digikey: 490-5528-1-ND or 399-5508-1-ND or 445-6010-1-ND] 100uF 6.3V -20%, +80% Y5V Ceramic Capacitor (Digikey: 490-4512-1-ND, Mouser: 81-GRM31CF50J107ZE1L)
C7 C9 C20 C28 = SparkFun-Capacitors:CAP: Capacitor Standard 0603 ceramic capacitor, and 0.1" leaded capacitor.
CN1 = microbuilder:MICROSD: MicroSD/Transflash Card Holder with SPI pinout 3M: 2908-05WB-MG 4UConnector: 19656 Footprint courtesy: Adafruit Industries
D3 D4 = 2n2907:DIODE: Diode SMADIODE - SMA Surface Mount Package 20V 1A Schottky Diode Digikey: 641-1014-6-ND DO-1N4148 - Through Hole Small Current Diode SOD-123 20V 1 A (.5mV Vf) Schottky Diode - Digikey: MBRX120TPMSCT-ND SOD-323 10V 570mA (.38mV Vf, 3ns) Schottky Diode - Digikey: ZLLS410CT-ND SOD-523 30V 30mA Schottky Diode (RB751S-40TE61) - Digikey: RB751S-40TE61CT-ND SOT23-R/W - SOT23 Package (R = Solder Paste/Reflow Ovens, W = Hand-Soldering) BAT54Film 40V 300mA - Digikey: 497-7162-1-ND
FB1-FB4 = microbuilder:FERRITE: Ferrite Bead 0603 MMZ1608B121C - 120 Ohm @ 100MHz, 600mA, 0.15 Ohm DC Resistance - Digikey: 445-2164-1-ND BK1608HW121-T - 120 Ohm, 600mA Ferrite Chip - Digikey: 587-1876-2-ND 0805 HZ0805B272R-10 - 2.7K Ohm @ 100MHz, 200mA, 0.8 Ohm DC Resistance - Digikey: 240-2504-1-ND (see also Murata BLM21BD272SN1L) MMZ2012Y152B - 1.5K Ohm @ 100MHz, 500mA, 0.4 Ohm DC Resistance - Digikey: 445-1560-1-ND - Mainly for high frequency (80-400MHz) MMZ2012R102A - 1K Ohm @ 100MHz, 500mA, 0.3 Ohm DC Resistance - Digikey: 445-1555-2-ND - More general purpose (10-200MHz)
IC1 IC2 = SparkFun-PowerIC:V_REG_LM1117: Voltage Regulator LM1117 Standard adjustable voltage regulator but in SMD form. Spark Fun Electronics SKU : COM-00595
ICSP = SmartPrj:PINHD-2X3: PIN HEADER
KEY00 KEY01-KEY09 KEY10-KEY35 S2-S4 = SparkFun-Electromechanical:SWITCH-MOMENTARY-2: Various NO switches- pushbuttons, reed, etc
POWER RX TX = led:LED: LED OSRAM: - CHIPLED LG R971, LG N971, LY N971, LG Q971, LY Q971, LO R971, LY R971 LH N974, LH R974 LS Q976, LO Q976, LY Q976 LO Q996 - Hyper CHIPLED LW Q18S LB Q993, LB Q99A, LB R99A - SideLED LS A670, LO A670, LY A670, LG A670, LP A670 LB A673, LV A673, LT A673, LW A673 LH A674 LY A675 LS A676, LA A676, LO A676, LY A676, LW A676 LS A679, LY A679, LG A679 - Hyper Micro SIDELED® LS Y876, LA Y876, LO Y876, LY Y876 LT Y87S - SmartLED LW L88C, LW L88S LB L89C, LB L89S, LG L890 LS L89K, LO L89K, LY L89K LS L896, LA L896, LO L896, LY L896 - TOPLED LS T670, LO T670, LY T670, LG T670, LP T670 LSG T670, LSP T670, LSY T670, LOP T670, LYG T670 LG T671, LOG T671, LSG T671 LB T673, LV T673, LT T673, LW T673 LH T674 LS T676, LA T676, LO T676, LY T676, LB T676, LH T676, LSB T676, LW T676 LB T67C, LV T67C, LT T67C, LS T67K, LO T67K, LY T67K, LW E67C LS E67B, LA E67B, LO E67B, LY E67B, LB E67C, LV E67C, LT E67C LW T67C LS T679, LY T679, LG T679 LS T770, LO T770, LY T770, LG T770, LP T770 LB T773, LV T773, LT T773, LW T773 LH T774 LS E675, LA E675, LY E675, LS T675 LS T776, LA T776, LO T776, LY T776, LB T776 LHGB T686 LT T68C, LB T68C - Hyper Mini TOPLED® LB M676 - Mini TOPLED Santana® LG M470 LS M47K, LO M47K, LY M47K Source: http://www.osram.convergy.de LUXEON: - LUMILED® LXK2-PW12-R00, LXK2-PW12-S00, LXK2-PW14-U00, LXK2-PW14-V00 LXK2-PM12-R00, LXK2-PM12-S00, LXK2-PM14-U00 LXK2-PE12-Q00, LXK2-PE12-R00, LXK2-PE12-S00, LXK2-PE14-T00, LXK2-PE14-U00 LXK2-PB12-K00, LXK2-PB12-L00, LXK2-PB12-M00, LXK2-PB14-N00, LXK2-PB14-P00, LXK2-PB14-Q00 LXK2-PR12-L00, LXK2-PR12-M00, LXK2-PR14-Q00, LXK2-PR14-R00 LXK2-PD12-Q00, LXK2-PD12-R00, LXK2-PD12-S00 LXK2-PH12-R00, LXK2-PH12-S00 LXK2-PL12-P00, LXK2-PL12-Q00, LXK2-PL12-R00 Source: www.luxeon.com KINGBRIGHT: KA-3528ASYC Source: www.kingbright.com
PTC R1-R37 R39-R79 = microbuilder:RESISTOR: Resistors For new designs, use the packages preceded by an '_' character since they are more reliable: The following footprints should be used on most boards: _0402 - Standard footprint for regular board layouts _0603 - Standard footprint for regular board layouts _0805 - Standard footprint for regular board layouts For extremely tight-pitch boards where space is at a premium, the following 'micro-pitch' footprints can be used (smaller pads, no silkscreen outline, etc.): _0402MP - Micro-pitch footprint for very dense/compact boards _0603MP - Micro-pitch footprint for very dense/compact boards _0805MP - Micro-pitch footprint for very dense/compact boards
Q1 Q2 = microbuilder:MOSFET-N: N-Channel Mosfet LEGEND VDS: Voltage Drain-Source ID: Drain Current RDS(ON): Drain-Source On-State Resistance VGS(TH): Gate-Source Threshold Voltage CISS: Drain-Source Input Capacitance SOT-23 Name VDS ID RDS(ON) VGS(TH) CISS Order Number 2N7002E 60V 260mA 2.5 Ohm 2.5V @ 250uA 26.7pF @ 25V 2N7002ET1GOSTR-ND BSH103 30V 850mA 400 mOhm 400mV @ 1mA 83pF @ 24V BSH103,235-ND BSS138 60V 320mA 1.6 Ohm 1.5V @ 250uA 50pF @ 10V Mouser: 771-BSS138PW115 DMN2075U-7 20V 4.2A 38 mOhm 1V @ 250 uA 594.3pF @ 10V DMN2075U-7DICT-ND * BSS138 good choice for I2C level-shifting POWERPAK 1212-8 Name VDS ID RDS(ON) VGS(TH) CISS Order Number Si7308DN 60V 6A 58 mOhm 3V @ 250uA 665pF @ 15V SI7308DN-T1-E3CT-ND
RESET = Tact_switch:TACT_SWITCH
SPEAKER = SparkFun-Connectors:M02: Standard 2-pin 0.1" header. Use with - straight break away headers ( PRT-00116) - right angle break away headers (PRT-00553) - swiss pins (PRT-00743) - machine pins (PRT-00117) - female headers (PRT-00115) Molex polarized connector foot print use with: PRT-08233 with associated crimp pins and housings. 2.54_SCREWTERM for use with PRT-10571. 3.5mm Screw Terminal footprints for PRT-08084 5mm Screw Terminal footprints for use with PRT-08433
TOUCH00 TOUCH01-TOUCH09 TOUCH10-TOUCH35 = RDD_Touch_Pad_Big:RDD_TOUCH_PAD
U3 = microbuilder:VS1053B: VS1053b Audio Codec - Ogg Vorbis/MP3/AAC/WMA/FLAC/MIDI
U5 = microbuilder:74HC4050D: 6-channel level shifter 74HC4050D - 2V-6V Supply SOIC16 Digikey: 74HC4050D,653-ND Mouser: 771-74HC4050D-T TSSOP16 Digikey: 296-9215-1-ND Mouser:
U8 = PAM8302:AUDIOAMP_PAM8302A: PAM8302A - 2.5W Class-D Mono Audio Amplifier MSOP8 = PAM8302AASCR
U9 = SmartPrj:ATMEGA32U4-XU
U11-U13 = mpr121:MPR121Q: MPR121Q - 12 Electrode Cap Touch Sensor Can drive up to 8 LEDs
U$32 = Sound_Volume:SOUND_VOLUME
U$42 U$44 = Swtich_NW3-SK-02A:SWITCH_SK-02A
U$47 = Murata_Crystal:MURATA_CRYSTAL
U$70 = Micro_USB:MICRO_USB
U$80 = Earphone:EARPHONE_DEV
Y1 = SparkFun-FreqCtrl:CRYSTAL: Various standard crystals. Proven footprints. Spark Fun Electronics SKU : COM-00534

## Net classes
2 gnd: width 0.254 mm, drill 0.61 mm, clearance 0.254 mm
3 usbvcc: width 0.254 mm, drill 0.61 mm, clearance 0.254 mm
4 aref: width 0.254 mm, drill 0.61 mm, clearance 0.254 mm